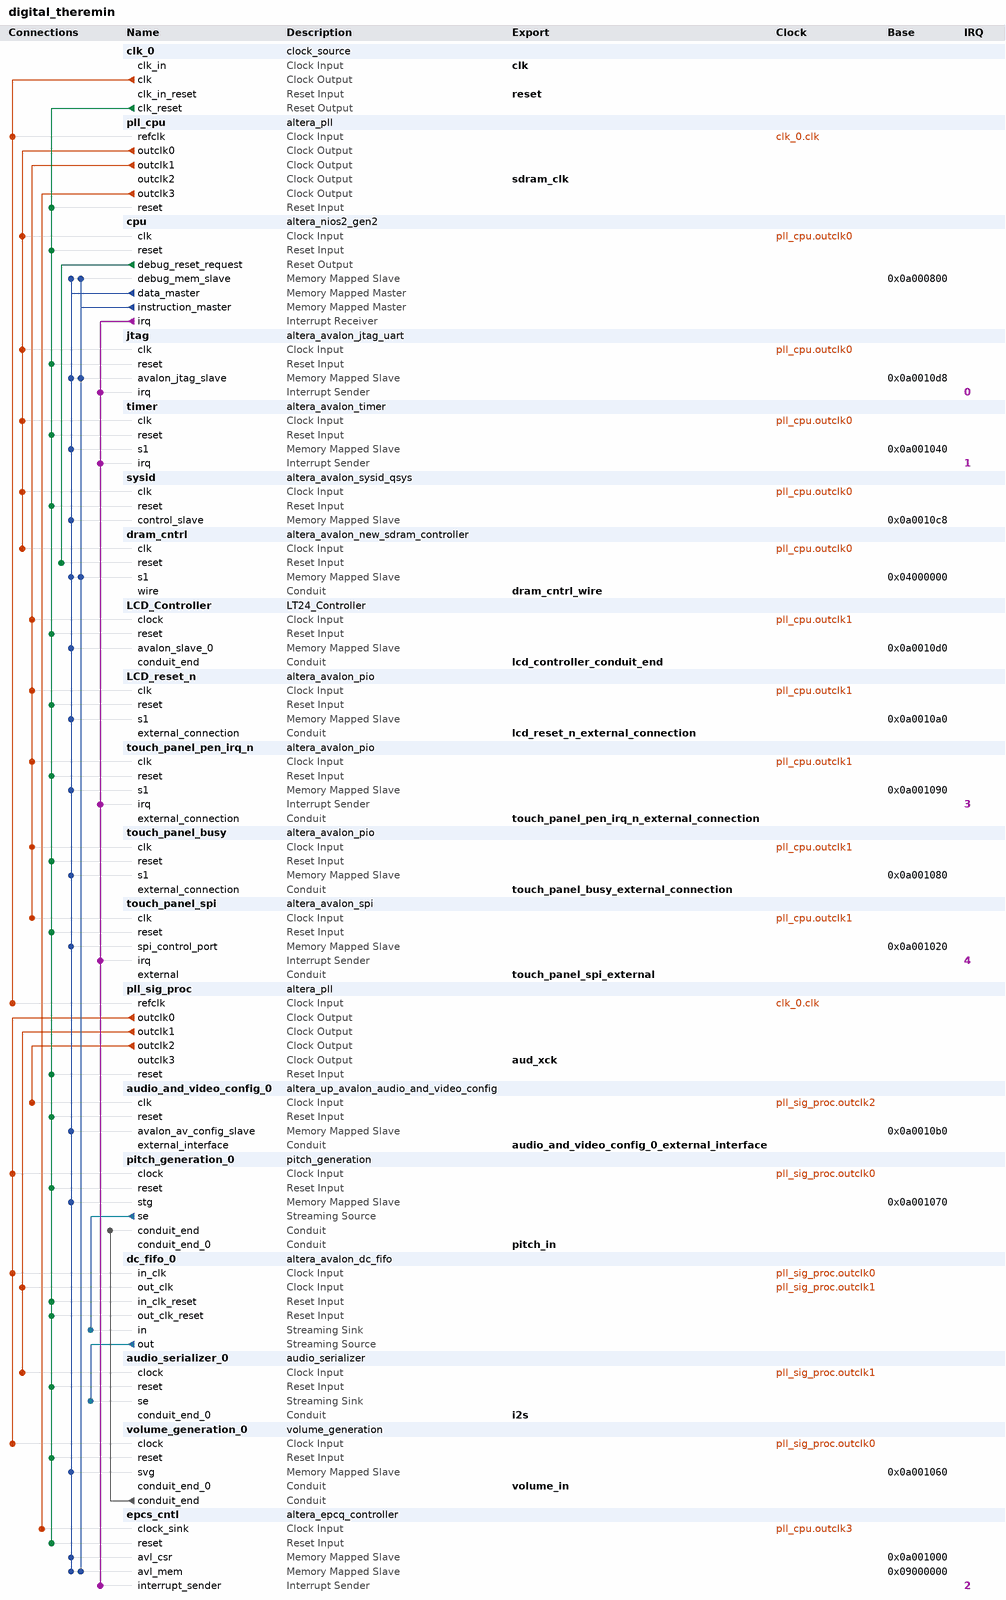
[diagram p0: system contents]
# Platform Designer (Qsys) system digital_theremin, Cyclone V 5CSEMA5F31C6
# Parameters at their usual value, and those the tool derives, are not listed.
package require -exact qsys 17.1
create_system digital_theremin
set_project_property DEVICE_FAMILY {Cyclone V}
set_project_property DEVICE 5CSEMA5F31C6

add_instance clk_0 clock_source 17.1
set_instance_parameter_value clk_0 clockFrequency 50000000

add_instance pll_cpu altera_pll 17.1
set_instance_parameter_value pll_cpu gui_device_speed_grade 1
set_instance_parameter_value pll_cpu gui_number_of_clocks 4
set_instance_parameter_value pll_cpu gui_operation_mode direct
set_instance_parameter_value pll_cpu gui_output_clock_frequency0 50.0
set_instance_parameter_value pll_cpu gui_output_clock_frequency1 15.0
set_instance_parameter_value pll_cpu gui_output_clock_frequency2 50.0
set_instance_parameter_value pll_cpu gui_output_clock_frequency3 25.0
set_instance_parameter_value pll_cpu gui_phase_shift2 -3333
set_instance_parameter_value pll_cpu gui_pll_mode {Integer-N PLL}
set_instance_parameter_value pll_cpu gui_reference_clock_frequency 50.0
set_instance_parameter_value pll_cpu gui_use_locked false

add_instance cpu altera_nios2_gen2 17.1
set_instance_parameter_value cpu dcache_size 2048
set_instance_parameter_value cpu dividerType srt2
set_instance_parameter_value cpu exceptionSlave dram_cntrl.s1
set_instance_parameter_value cpu icache_size 4096
set_instance_parameter_value cpu impl Fast
set_instance_parameter_value cpu resetOffset 8323072
set_instance_parameter_value cpu resetSlave epcs_cntl.avl_mem

add_instance jtag altera_avalon_jtag_uart 17.1
set_instance_parameter_value jtag simInteractiveOptions NO_INTERACTIVE_WINDOWS

add_instance timer altera_avalon_timer 17.1
set_instance_parameter_value timer period 1
set_instance_parameter_value timer periodUnits MSEC

add_instance sysid altera_avalon_sysid_qsys 17.1
set_instance_parameter_value sysid id 1

add_instance dram_cntrl altera_avalon_new_sdram_controller 17.1
set_instance_parameter_value dram_cntrl TAC 5.4
set_instance_parameter_value dram_cntrl TRCD 15.0
set_instance_parameter_value dram_cntrl TRP 15.0
set_instance_parameter_value dram_cntrl casLatency 3
set_instance_parameter_value dram_cntrl columnWidth 10
set_instance_parameter_value dram_cntrl dataWidth 16
set_instance_parameter_value dram_cntrl generateSimulationModel false
set_instance_parameter_value dram_cntrl model single_Micron_MT48LC4M32B2_7_chip
set_instance_parameter_value dram_cntrl numberOfBanks 4
set_instance_parameter_value dram_cntrl numberOfChipSelects 1
set_instance_parameter_value dram_cntrl powerUpDelay 100.0
set_instance_parameter_value dram_cntrl refreshPeriod 7.8125
set_instance_parameter_value dram_cntrl rowWidth 13

add_instance LCD_Controller LT24_Controller 1.0

add_instance LCD_reset_n altera_avalon_pio 17.1
set_instance_parameter_value LCD_reset_n direction Output
set_instance_parameter_value LCD_reset_n width 1

add_instance touch_panel_pen_irq_n altera_avalon_pio 17.1
set_instance_parameter_value touch_panel_pen_irq_n captureEdge true
set_instance_parameter_value touch_panel_pen_irq_n direction Input
set_instance_parameter_value touch_panel_pen_irq_n edgeType FALLING
set_instance_parameter_value touch_panel_pen_irq_n generateIRQ true
set_instance_parameter_value touch_panel_pen_irq_n irqType EDGE
set_instance_parameter_value touch_panel_pen_irq_n width 1

add_instance touch_panel_busy altera_avalon_pio 17.1
set_instance_parameter_value touch_panel_busy direction Input
set_instance_parameter_value touch_panel_busy width 1

add_instance touch_panel_spi altera_avalon_spi 17.1
set_instance_parameter_value touch_panel_spi clockPolarity 0
set_instance_parameter_value touch_panel_spi dataWidth 8
set_instance_parameter_value touch_panel_spi masterSPI true
set_instance_parameter_value touch_panel_spi numberOfSlaves 1
set_instance_parameter_value touch_panel_spi targetClockRate 32000

add_instance pll_sig_proc altera_pll 17.1
set_instance_parameter_value pll_sig_proc gui_device_speed_grade 1
set_instance_parameter_value pll_sig_proc gui_number_of_clocks 4
set_instance_parameter_value pll_sig_proc gui_operation_mode direct
set_instance_parameter_value pll_sig_proc gui_output_clock_frequency0 54.0
set_instance_parameter_value pll_sig_proc gui_output_clock_frequency1 24.0
set_instance_parameter_value pll_sig_proc gui_output_clock_frequency2 12.0
set_instance_parameter_value pll_sig_proc gui_output_clock_frequency3 12.0
set_instance_parameter_value pll_sig_proc gui_pll_mode {Integer-N PLL}
set_instance_parameter_value pll_sig_proc gui_reference_clock_frequency 50.0
set_instance_parameter_value pll_sig_proc gui_use_locked false

add_instance audio_and_video_config_0 altera_up_avalon_audio_and_video_config 17.1
set_instance_parameter_value audio_and_video_config_0 audio_in {Microphone to ADC}
set_instance_parameter_value audio_and_video_config_0 bit_length 24
set_instance_parameter_value audio_and_video_config_0 board DE1-SoC
set_instance_parameter_value audio_and_video_config_0 eai false
set_instance_parameter_value audio_and_video_config_0 line_in_bypass false
set_instance_parameter_value audio_and_video_config_0 sampling_rate {48 kHz}

add_instance pitch_generation_0 pitch_generation 1.0
set_instance_parameter_value pitch_generation_0 FIRBits 27
set_instance_parameter_value pitch_generation_0 StreamingBits 24
set_instance_parameter_value pitch_generation_0 cic1Bits 21
set_instance_parameter_value pitch_generation_0 cic2Bits 25
set_instance_parameter_value pitch_generation_0 cic3Bits 28
set_instance_parameter_value pitch_generation_0 dat_len_avl 32

add_instance dc_fifo_0 altera_avalon_dc_fifo 17.1
set_instance_parameter_value dc_fifo_0 BITS_PER_SYMBOL 24
set_instance_parameter_value dc_fifo_0 FIFO_DEPTH 4
set_instance_parameter_value dc_fifo_0 USE_PACKETS 0

add_instance audio_serializer_0 audio_serializer 1.0

add_instance volume_generation_0 volume_generation 1.0
set_instance_parameter_value volume_generation_0 cic1Bits 21
set_instance_parameter_value volume_generation_0 cic2Bits 25
set_instance_parameter_value volume_generation_0 cic3Bits 28
set_instance_parameter_value volume_generation_0 dat_len_avl 32

add_instance epcs_cntl altera_epcq_controller 17.1
set_instance_parameter_value epcs_cntl CHIP_SELS 1
set_instance_parameter_value epcs_cntl DDASI 0
set_instance_parameter_value epcs_cntl FLASH_TYPE EPCS128
set_instance_parameter_value epcs_cntl IO_MODE STANDARD
set_instance_parameter_value epcs_cntl UNIQUE_ID {$${FILENAME}_epcs_cntl}
set_instance_parameter_value epcs_cntl clkFreq 25000000

# connections
add_connection clk_0.clk pll_cpu.refclk clock
add_connection clk_0.clk pll_sig_proc.refclk clock
add_connection pll_cpu.outclk0 cpu.clk clock
add_connection pll_cpu.outclk0 dram_cntrl.clk clock
add_connection pll_cpu.outclk0 jtag.clk clock
add_connection pll_cpu.outclk0 sysid.clk clock
add_connection pll_cpu.outclk0 timer.clk clock
add_connection pll_cpu.outclk1 LCD_Controller.clock clock
add_connection pll_cpu.outclk1 LCD_reset_n.clk clock
add_connection pll_cpu.outclk1 touch_panel_busy.clk clock
add_connection pll_cpu.outclk1 touch_panel_pen_irq_n.clk clock
add_connection pll_cpu.outclk1 touch_panel_spi.clk clock
add_connection pll_cpu.outclk3 epcs_cntl.clock_sink clock
add_connection pll_sig_proc.outclk0 dc_fifo_0.in_clk clock
add_connection pll_sig_proc.outclk0 pitch_generation_0.clock clock
add_connection pll_sig_proc.outclk0 volume_generation_0.clock clock
add_connection pll_sig_proc.outclk1 audio_serializer_0.clock clock
add_connection pll_sig_proc.outclk1 dc_fifo_0.out_clk clock
add_connection pll_sig_proc.outclk2 audio_and_video_config_0.clk clock
add_connection clk_0.clk_reset audio_and_video_config_0.reset reset
add_connection clk_0.clk_reset audio_serializer_0.reset reset
add_connection clk_0.clk_reset cpu.reset reset
add_connection clk_0.clk_reset dc_fifo_0.in_clk_reset reset
add_connection clk_0.clk_reset dc_fifo_0.out_clk_reset reset
add_connection clk_0.clk_reset epcs_cntl.reset reset
add_connection clk_0.clk_reset jtag.reset reset
add_connection clk_0.clk_reset LCD_Controller.reset reset
add_connection clk_0.clk_reset LCD_reset_n.reset reset
add_connection clk_0.clk_reset pitch_generation_0.reset reset
add_connection clk_0.clk_reset pll_cpu.reset reset
add_connection clk_0.clk_reset pll_sig_proc.reset reset
add_connection clk_0.clk_reset sysid.reset reset
add_connection clk_0.clk_reset timer.reset reset
add_connection clk_0.clk_reset touch_panel_busy.reset reset
add_connection clk_0.clk_reset touch_panel_pen_irq_n.reset reset
add_connection clk_0.clk_reset touch_panel_spi.reset reset
add_connection clk_0.clk_reset volume_generation_0.reset reset
add_connection cpu.debug_reset_request dram_cntrl.reset reset
add_connection cpu.data_master audio_and_video_config_0.avalon_av_config_slave avalon
set_connection_parameter_value cpu.data_master/audio_and_video_config_0.avalon_av_config_slave baseAddress 0x0a0010b0
add_connection cpu.data_master cpu.debug_mem_slave avalon
set_connection_parameter_value cpu.data_master/cpu.debug_mem_slave baseAddress 0x0a000800
add_connection cpu.data_master dram_cntrl.s1 avalon
set_connection_parameter_value cpu.data_master/dram_cntrl.s1 baseAddress 0x04000000
add_connection cpu.data_master epcs_cntl.avl_csr avalon
set_connection_parameter_value cpu.data_master/epcs_cntl.avl_csr baseAddress 0x0a001000
add_connection cpu.data_master epcs_cntl.avl_mem avalon
set_connection_parameter_value cpu.data_master/epcs_cntl.avl_mem baseAddress 0x09000000
add_connection cpu.data_master jtag.avalon_jtag_slave avalon
set_connection_parameter_value cpu.data_master/jtag.avalon_jtag_slave baseAddress 0x0a0010d8
add_connection cpu.data_master LCD_Controller.avalon_slave_0 avalon
set_connection_parameter_value cpu.data_master/LCD_Controller.avalon_slave_0 baseAddress 0x0a0010d0
add_connection cpu.data_master LCD_reset_n.s1 avalon
set_connection_parameter_value cpu.data_master/LCD_reset_n.s1 baseAddress 0x0a0010a0
add_connection cpu.data_master pitch_generation_0.stg avalon
set_connection_parameter_value cpu.data_master/pitch_generation_0.stg baseAddress 0x0a001070
add_connection cpu.data_master sysid.control_slave avalon
set_connection_parameter_value cpu.data_master/sysid.control_slave baseAddress 0x0a0010c8
add_connection cpu.data_master timer.s1 avalon
set_connection_parameter_value cpu.data_master/timer.s1 baseAddress 0x0a001040
add_connection cpu.data_master touch_panel_busy.s1 avalon
set_connection_parameter_value cpu.data_master/touch_panel_busy.s1 baseAddress 0x0a001080
add_connection cpu.data_master touch_panel_pen_irq_n.s1 avalon
set_connection_parameter_value cpu.data_master/touch_panel_pen_irq_n.s1 baseAddress 0x0a001090
add_connection cpu.data_master touch_panel_spi.spi_control_port avalon
set_connection_parameter_value cpu.data_master/touch_panel_spi.spi_control_port baseAddress 0x0a001020
add_connection cpu.data_master volume_generation_0.svg avalon
set_connection_parameter_value cpu.data_master/volume_generation_0.svg baseAddress 0x0a001060
add_connection cpu.instruction_master cpu.debug_mem_slave avalon
set_connection_parameter_value cpu.instruction_master/cpu.debug_mem_slave baseAddress 0x0a000800
add_connection cpu.instruction_master dram_cntrl.s1 avalon
set_connection_parameter_value cpu.instruction_master/dram_cntrl.s1 baseAddress 0x04000000
add_connection cpu.instruction_master epcs_cntl.avl_mem avalon
set_connection_parameter_value cpu.instruction_master/epcs_cntl.avl_mem baseAddress 0x09000000
add_connection cpu.instruction_master jtag.avalon_jtag_slave avalon
set_connection_parameter_value cpu.instruction_master/jtag.avalon_jtag_slave baseAddress 0x0a0010d8
add_connection dc_fifo_0.out audio_serializer_0.se avalon_streaming
add_connection pitch_generation_0.se dc_fifo_0.in avalon_streaming
add_connection volume_generation_0.conduit_end pitch_generation_0.conduit_end conduit
add_connection cpu.irq epcs_cntl.interrupt_sender interrupt
set_connection_parameter_value cpu.irq/epcs_cntl.interrupt_sender irqNumber 2
add_connection cpu.irq jtag.irq interrupt
set_connection_parameter_value cpu.irq/jtag.irq irqNumber 0
add_connection cpu.irq timer.irq interrupt
set_connection_parameter_value cpu.irq/timer.irq irqNumber 1
add_connection cpu.irq touch_panel_pen_irq_n.irq interrupt
set_connection_parameter_value cpu.irq/touch_panel_pen_irq_n.irq irqNumber 3
add_connection cpu.irq touch_panel_spi.irq interrupt
set_connection_parameter_value cpu.irq/touch_panel_spi.irq irqNumber 4

# exported interfaces
add_interface aud_xck clock source
set_interface_property aud_xck EXPORT_OF pll_sig_proc.outclk3
add_interface audio_and_video_config_0_external_interface conduit end
set_interface_property audio_and_video_config_0_external_interface EXPORT_OF audio_and_video_config_0.external_interface
add_interface clk clock sink
set_interface_property clk EXPORT_OF clk_0.clk_in
add_interface dram_cntrl_wire conduit end
set_interface_property dram_cntrl_wire EXPORT_OF dram_cntrl.wire
add_interface i2s conduit end
set_interface_property i2s EXPORT_OF audio_serializer_0.conduit_end_0
add_interface lcd_controller_conduit_end conduit end
set_interface_property lcd_controller_conduit_end EXPORT_OF LCD_Controller.conduit_end
add_interface lcd_reset_n_external_connection conduit end
set_interface_property lcd_reset_n_external_connection EXPORT_OF LCD_reset_n.external_connection
add_interface pitch_in conduit end
set_interface_property pitch_in EXPORT_OF pitch_generation_0.conduit_end_0
add_interface reset reset sink
set_interface_property reset EXPORT_OF clk_0.clk_in_reset
add_interface sdram_clk clock source
set_interface_property sdram_clk EXPORT_OF pll_cpu.outclk2
add_interface touch_panel_busy_external_connection conduit end
set_interface_property touch_panel_busy_external_connection EXPORT_OF touch_panel_busy.external_connection
add_interface touch_panel_pen_irq_n_external_connection conduit end
set_interface_property touch_panel_pen_irq_n_external_connection EXPORT_OF touch_panel_pen_irq_n.external_connection
add_interface touch_panel_spi_external conduit end
set_interface_property touch_panel_spi_external EXPORT_OF touch_panel_spi.external
add_interface volume_in conduit end
set_interface_property volume_in EXPORT_OF volume_generation_0.conduit_end_0

set_interconnect_requirement {$system} qsys_mm.clockCrossingAdapter HANDSHAKE
set_interconnect_requirement {$system} qsys_mm.enableEccProtection FALSE
set_interconnect_requirement {$system} qsys_mm.insertDefaultSlave FALSE
set_interconnect_requirement {$system} qsys_mm.maxAdditionalLatency 1

save_system digital_theremin.qsys
